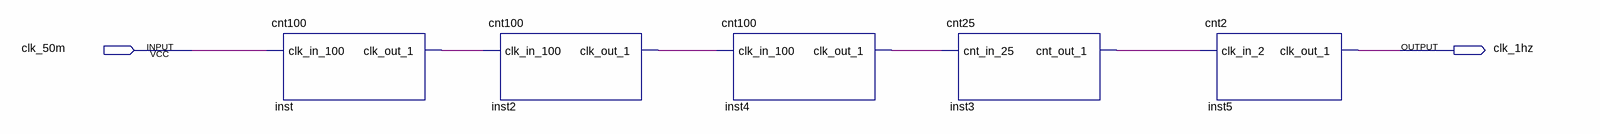
[diagram p0: schematic sheet]
// Quartus schematic mxh.bdf as structural Verilog: 5 symbols, 2 pins
module mxh (
  input  clk_50m,
  output clk_1hz
);

  wire inst2_clk_out_1, inst3_cnt_out_1, inst4_clk_out_1, inst_clk_out_1;

  cnt100 inst (.clk_in_100(clk_50m), .clk_out_1(inst_clk_out_1));
  cnt100 inst2 (.clk_in_100(inst_clk_out_1), .clk_out_1(inst2_clk_out_1));
  cnt100 inst4 (.clk_in_100(inst2_clk_out_1), .clk_out_1(inst4_clk_out_1));
  cnt25 inst3 (.cnt_in_25(inst4_clk_out_1), .cnt_out_1(inst3_cnt_out_1));
  cnt2 inst5 (.clk_in_2(inst3_cnt_out_1), .clk_out_1(clk_1hz));
endmodule
